# EAGLE design mac-protoshield (EAGLE 6.4)
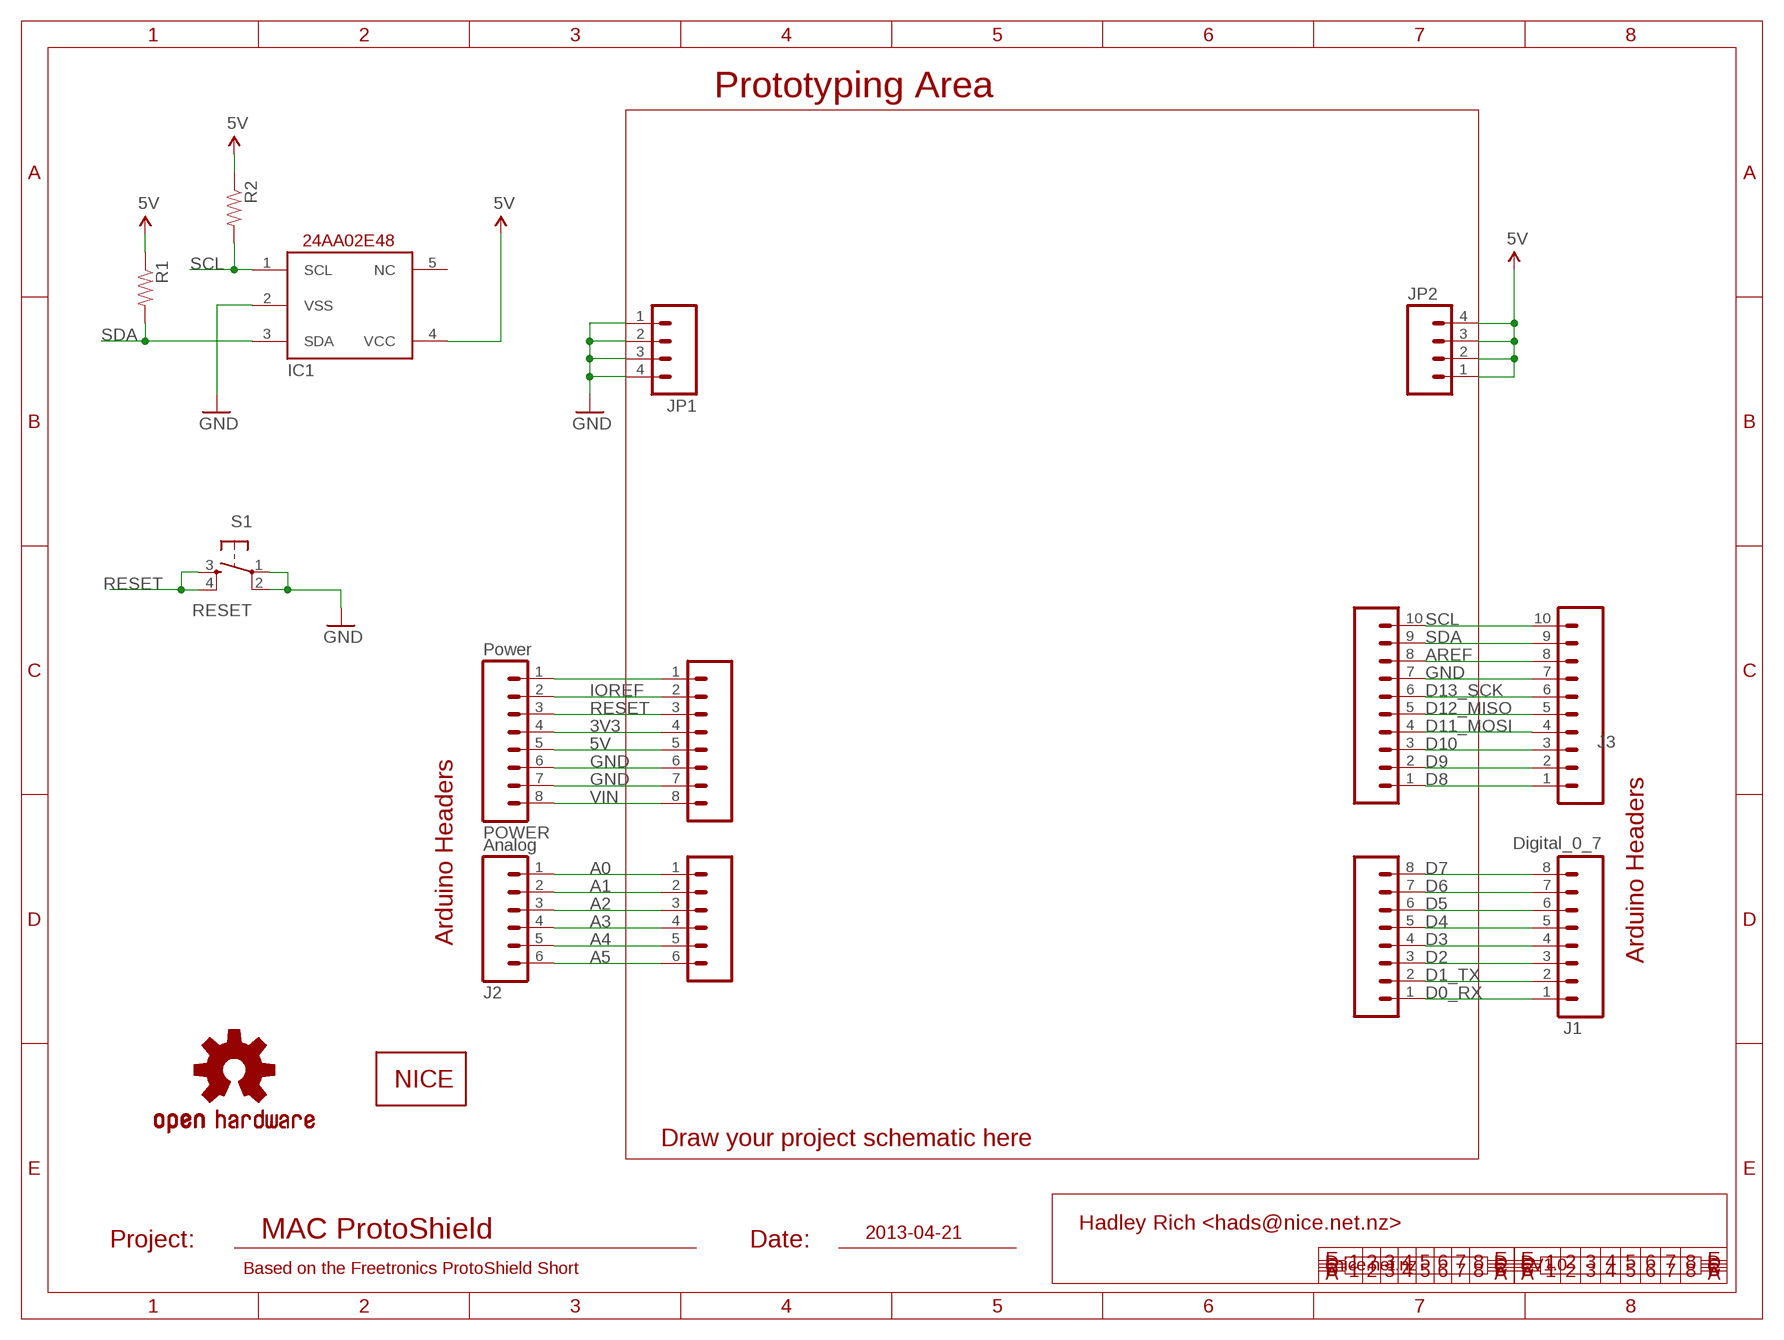
[diagram p0: schematic, sheet 1]

## Parts
IC1  24AA-2E48  [SOT23-5]
J1  Digital_0_7  M081X08  [1X08]
J2  Analog  M06SIP  [1X06]
J3  Digital_8_13  M10"  [1X10]
JP1  M04PTH  [1X04]
JP2  M04PTH  [1X04]
LOGO1  OSHW-LOGOS  [OSHW-LOGO-S]
POWER  Power  M081X08  [1X08]
R1  RESISTOR0805-RES  [0805]
R2  RESISTOR0805-RES  [0805]
S1  RESET  TAC_SWITCHPTH  [TACTILE-PTH]
SL1  Digital_0_7  M081X08  [1X08]
SL2  Analog  M06SIP  [1X06]
SL3  Digital_8_13  M10"  [1X10]
SLP  Power  M081X08  [1X08]
U$5  NICE-LOGO04  [NICE-LOGO-04]

## Nets
3V3: POWER.4 SLP.4
5V: IC1.4(VCC) JP2.1 JP2.2 JP2.3 JP2.4 POWER.5 R1.1 R2.1 SLP.5
A0: J2.1 SL2.1
A1: J2.2 SL2.2
A2: J2.3 SL2.3
A3: J2.4 SL2.4
A4: J2.5 SL2.5
A5: J2.6 SL2.6
AREF: J3.8 SL3.8
D0_RX: J1.1 SL1.1
D1_TX: J1.2 SL1.2
D2: J1.3 SL1.3
D3: J1.4 SL1.4
D4: J1.5 SL1.5
D5: J1.6 SL1.6
D6: J1.7 SL1.7
D7: J1.8 SL1.8
D8: J3.1 SL3.1
D9: J3.2 SL3.2
D10: J3.3 SL3.3
D11_MOSI: J3.4 SL3.4
D12_MISO: J3.5 SL3.5
D13_SCK: J3.6 SL3.6
GND: IC1.2(VSS) J3.7 JP1.1 JP1.2 JP1.3 JP1.4 POWER.6 POWER.7 S1.1 S1.2 SL3.7 SLP.6 SLP.7
IOREF: POWER.2 SLP.2
N$12: POWER.1 SLP.1
RESET: POWER.3 S1.3 S1.4 SLP.3
SCL: IC1.1(SCL) J3.10 R2.2 SL3.10
SDA: IC1.3(SDA) J3.9 R1.2 SL3.9
VIN: POWER.8 SLP.8
Unconnected: IC1.5(NC)

## Notes on the sheet
- Prototyping Area
- Arduino Headers
- Arduino Headers
- Draw your project schematic here
- Hadley Rich <hads@nice.net.nz>
- MAC ProtoShield | 2013-04-21
- Project: | Date:
- Based on the Freetronics ProtoShield Short | nice.net.nz | V1.0

## Library data of the parts
IC1 = nice:24AA-2E48: Microchip 24AA-2E48 2Kb EEPROM with pre-programmed EUI-48 Identity (MAC Address) SOT-23-5 package
J1 POWER SL1 SLP = SparkFun-Connectors:M08: Header 8 Standard 8-pin 0.1" header. Use with straight break away headers (SKU : PRT-00116), right angle break away headers (PRT-00553), swiss pins (PRT-00743), machine pins (PRT-00117), and female headers (PRT-00115).
J2 SL2 = SparkFun-Connectors:M06: Header 6 Standard 6-pin 0.1" header. Use with straight break away headers (SKU : PRT-00116), right angle break away headers (PRT-00553), swiss pins (PRT-00743), machine pins (PRT-00117), and female headers (PRT-00115). Molex polarized connector foot print use with SKU : PRT-08094 with associated crimp pins and housings. NOTES ON THE VARIANTS LOCK and LOCK_LONGPADS... This footprint was designed to help hold the alignment of a through-hole component (i.e. 6-pin header) while soldering it into place. You may notice that each hole has been shifted either up or down by 0.005 of an inch from it's more standard position (which is a perfectly straight line). This slight alteration caused the pins (the squares in the middle) to touch the edges of the holes. Because they are alternating, it causes a "brace" to hold the component in place. 0.005 has proven to be the perfect amount of "off-center" position when using our standard breakaway headers. Although looks a little odd when you look at the bare footprint, once you have a header in there, the alteration is very hard to notice. Also, if you push a header all the way into place, it is covered up entirely on the bottom side. This idea of altering the position of holes to aid alignment will be further integrated into the Sparkfun Library for other footprints. It can help hold any component with 3 or more connection pins.
J3 SL3 = SparkFun-Connectors:M10: Header 10 Standard 10-pin 0.1" header. Use with straight break away headers (SKU : PRT-00116), right angle break away headers (PRT-00553), swiss pins (PRT-00743), machine pins (PRT-00117), and female headers (PRT-00115).
JP1 JP2 = SparkFun-Connectors:M04: Header 4 Standard 4-pin 0.1" header. Use with straight break away headers (SKU : PRT-00116), right angle break away headers (PRT-00553), swiss pins (PRT-00743), machine pins (PRT-00117), and female headers (PRT-00115). Molex polarized connector foot print use with SKU : PRT-08231 with associated crimp pins and housings. 1MM SMD Version SKU: PRT-10208
LOGO1 = SparkFun-Aesthetics:OSHW-LOGO: Open Source Hardware Logo This logo indicates the piece of hardware it is found on incorporates a OSHW license and/or adheres to the definition of open source hardware found here: http://freedomdefined.org/OSHW
R1 R2 = SparkFun-Passives:RESISTOR: Resistor Basic schematic elements and footprints for 0603, 1206, and PTH resistors.
S1 = freetronics:TAC_SWITCH: Momentary Switch Button commonly used for reset or general input. Spark Fun Electronics SKU : COM-00097
U$5 = nice:NICE-LOGO

## Board
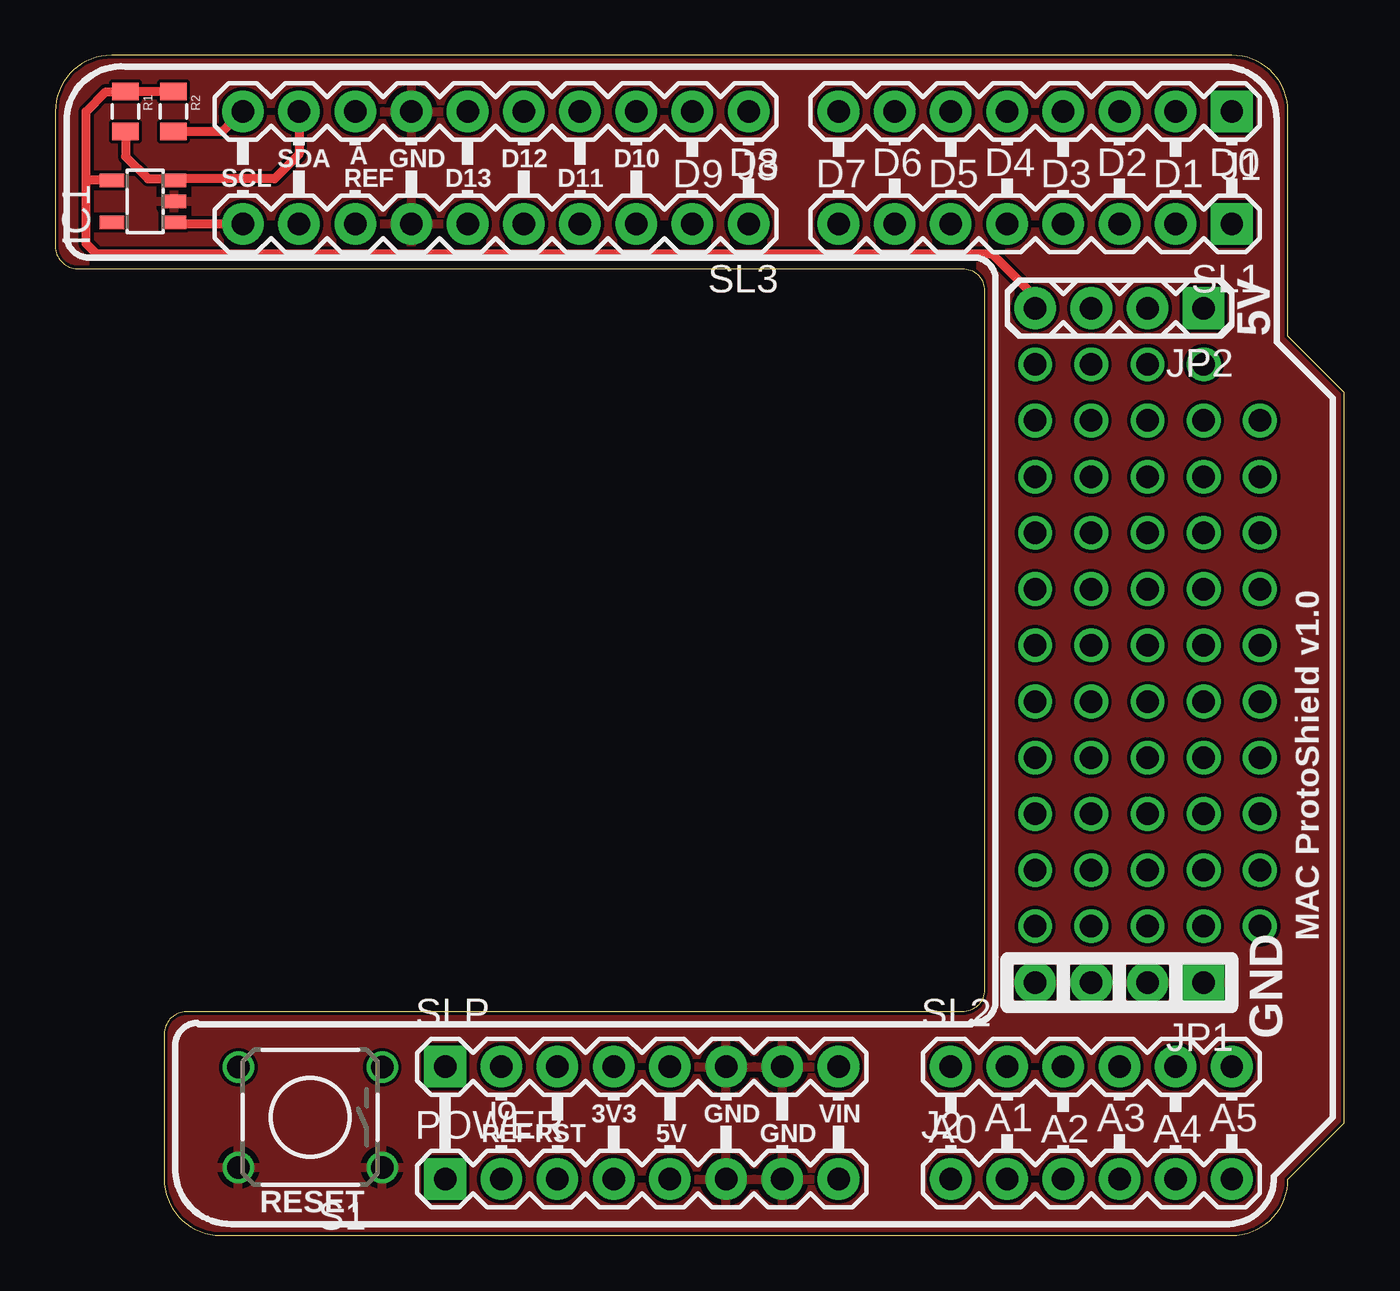
[diagram p1: board, top side]
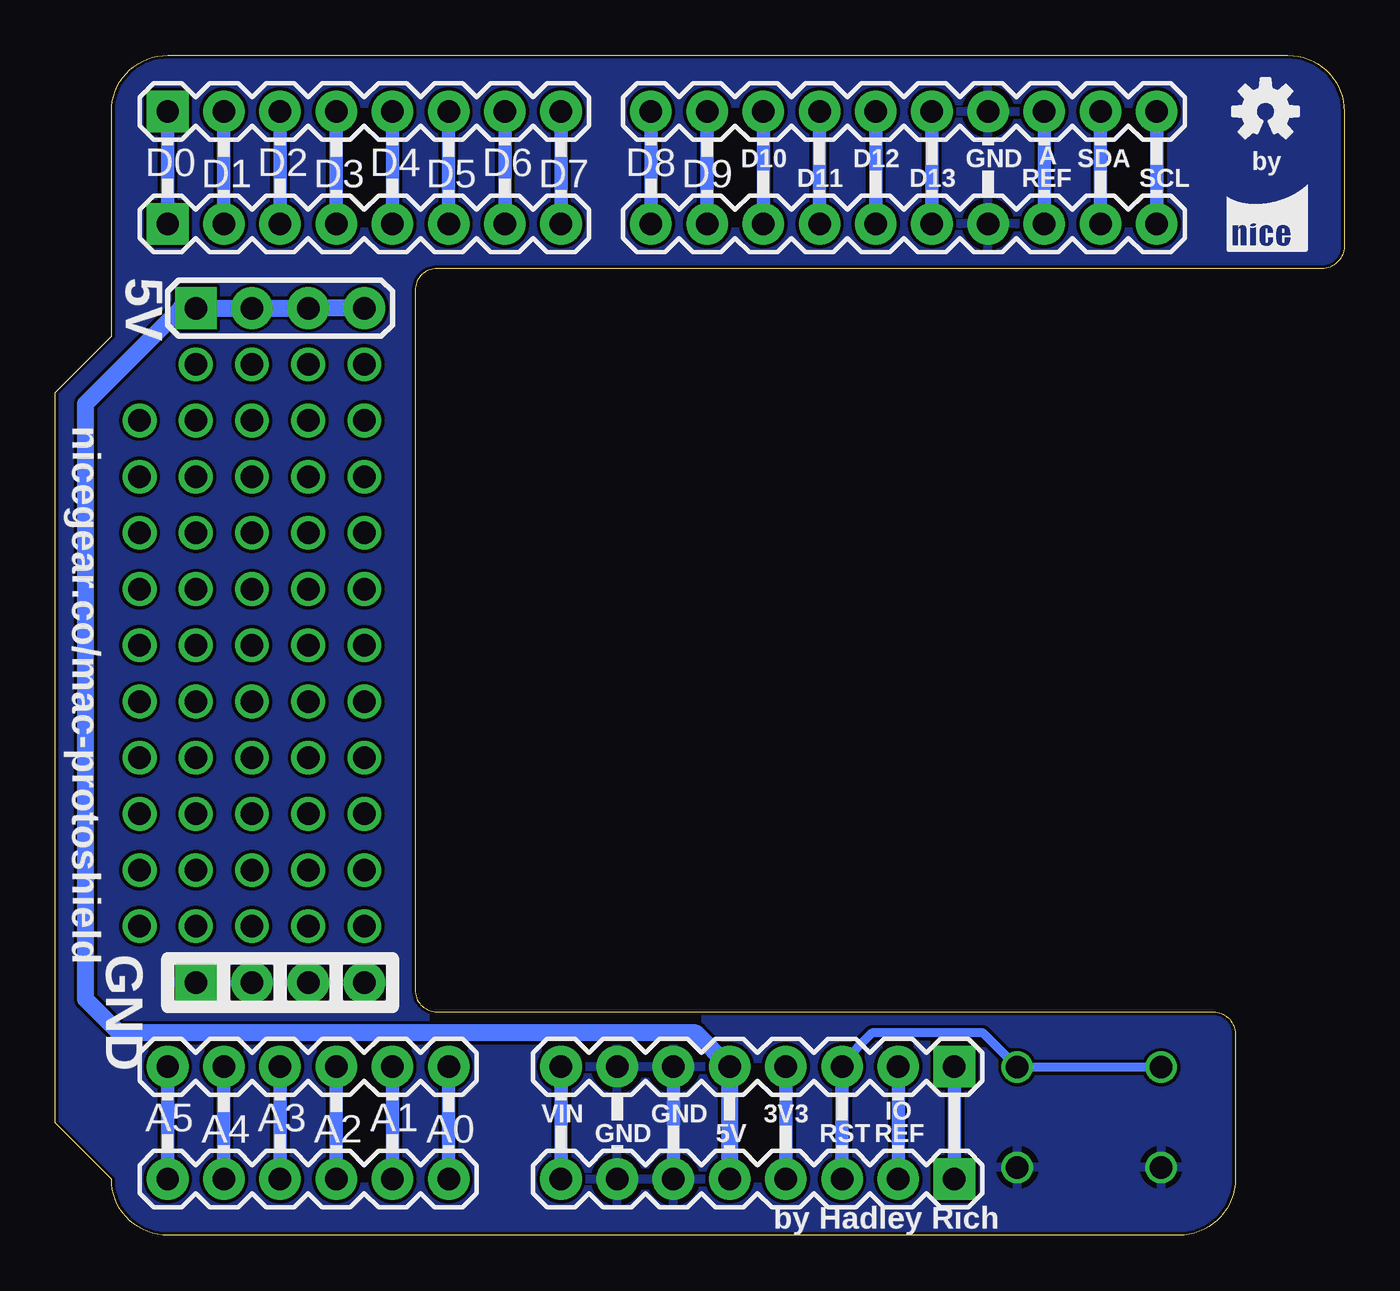
[diagram p2: board, bottom side, seen from below]

Size 58.26 x 53.34 mm. Coordinates in mm from the lower left corner, seen from the top.
Outline: 4.92,2.54 arc90 7.46,0 53.18,0 arc90 55.72,2.54 58.26,5.08 58.26,38.1 55.72,40.64 55.72,50.8 arc90 53.18,53.34 2.54,53.34 arc90 0,50.8 0,44.7 arc90 1,43.7 41,43.7 arc-90 42,42.7 42,11.1 arc-90 41,10.1 5.92,10.1 arc90 4.92,9.1 4.92,2.54
Copper layers (1*16): Top 0.035mm / dielectric 1.5mm / Bottom 0.035mm
Design rules "hads": minimum track width 6mil, minimum drill 0.3mm, track to track 6mil, track to pad 6mil, pad to pad 8mil, via to via 6mil, smd to smd 6mil, copper to edge 6mil, drill to drill 6mil, minimum pad ring 6mil, minimum via ring 10mil, stop-mask expansion 4mil, vias tented up to drill 25mil, thermal gap 10mil

### Footprints (pad centres in the part's own frame; a part is rotated, then mirrored left to right if it is on the bottom)
SOT23-5 = smd 0.6 x 1.1: 1 -0.95,-1.3; 2 0,-1.3; 3 0.95,-1.3; 4 0.95,1.5; 5 -0.95,1.5
1X08 = drill 1.016 pad 1.88 square: 1 0,0 | drill 1.016 pad 1.88: 2 2.54,0; 3 5.08,0; 4 7.62,0; 5 10.16,0; 6 12.7,0; 7 15.24,0; 8 17.78,0
1X06 = drill 1.016 pad 1.88: 1 0,0; 2 2.54,0; 3 5.08,0; 4 7.62,0; 5 10.16,0; 6 12.7,0
1X10 = drill 1.016 pad 1.88: 1 0,0; 2 2.54,0; 3 5.08,0; 4 7.62,0; 5 10.16,0; 6 12.7,0; 7 15.24,0; 8 17.78,0; 9 20.32,0; 10 22.86,0
1X04 = drill 1.016 pad 1.88 square: 1 0,0 | drill 1.016 pad 1.88: 2 2.54,0; 3 5.08,0; 4 7.62,0
0805 = smd 0.8 x 1.2: 1 -0.9,0; 2 0.9,0
TACTILE-PTH = drill 1.016: 1 -3.251,2.261; 2 3.251,2.261; 3 -3.251,-2.261; 4 3.251,-2.261

### Placement (x,y rotation side)
IC1  4.06,46.74 90 top
J1  53.18,50.8 180 top
J2  40.48,2.54 0 top
J3  31.34,50.8 180 top
JP1  51.91,11.43 180 top
JP2  51.91,41.91 180 top
LOGO1  3.56,50.8 0 bottom
POWER  17.62,2.54 0 top
R1  3.17,50.8 270 top
R2  5.33,50.8 270 top
S1  11.52,5.33 180 top
SL1  53.18,45.72 180 top
SL2  40.48,7.62 0 top
SL3  31.34,45.72 180 top
SLP  17.62,7.62 0 top
U$5  4.57,45.47 0 bottom

### Tracks (layer width: path | path; a pad name or v marks a point on that pad's centre or on a via)
3V3
  Bottom 0.61: SLP.4 POWER.4
5V
  Top 0.406: JP2.4 44.29,42.41 42.35,44.35 1.88,44.35 1.4,44.83 1.4,47.62 | R2.1 R1.1 3.14,51.69 2.29,51.69 1.4,50.8 1.4,47.62 | IC1.4 1.46,47.69 1.4,47.62
  Bottom 0.762: JP2.4 JP2.3 JP2.2 JP2.1 | POWER.5 SLP.5 29.3,9.14 55.37,9.14 56.9,10.67 56.9,37.59 52.58,41.91
  Bottom 0.813: 52.58,41.91 JP2.1
A0
  Bottom 0.61: J2.1 SL2.1
A1
  Bottom 0.61: J2.2 SL2.2
A2
  Bottom 0.61: J2.3 SL2.3
A3
  Bottom 0.61: J2.4 SL2.4
A4
  Bottom 0.61: J2.5 SL2.5
A5
  Bottom 0.61: J2.6 SL2.6
AREF
  Bottom 0.61: SL3.8 J3.8
D0_RX
  Bottom 0.61: SL1.1 J1.1
D1_TX
  Bottom 0.61: SL1.2 J1.2
D2
  Bottom 0.61: SL1.3 J1.3
D3
  Bottom 0.61: SL1.4 J1.4
D4
  Bottom 0.61: SL1.5 J1.5
D5
  Bottom 0.61: SL1.6 J1.6
D6
  Bottom 0.61: SL1.7 J1.7
D7
  Bottom 0.61: SL1.8 J1.8
D8
  Bottom 0.406: 31.24,45.72 SL3.1 31.34,45.56
  Bottom 0.61: J3.1 SL3.1
D9
  Bottom 0.61: SL3.2 J3.2
D10
  Bottom 0.61: SL3.3 J3.3
D11_MOSI
  Bottom 0.61: SL3.4 J3.4
D12_MISO
  Bottom 0.61: SL3.5 J3.5
D13_SCK
  Bottom 0.61: SL3.6 J3.6
GND
  Bottom 0.61: POWER.6 SLP.6
  pour Bottom: 0,50.8 arc-74 2.54,53.34 53.18,53.34 arc-74 55.72,50.8 55.72,40.64 58.26,38.1 58.26,5.08 55.72,2.54 arc-74 53.18,0 7.46,0 arc-74 4.92,2.54 4.92,9.1 arc-90 5.92,10.1 41,10.1 arc90 42,11.1 42,42.7 arc90 41,43.7 1,43.7 arc-90 0,44.7
  pour Top: 0,50.8 arc-74 2.54,53.34 53.18,53.34 arc-74 55.72,50.8 55.72,40.64 58.26,38.1 58.26,5.08 55.72,2.54 arc-74 53.18,0 7.46,0 arc-74 4.92,2.54 4.92,9.1 arc-90 5.92,10.1 41,10.1 arc90 42,11.1 42,42.7 arc90 41,43.7 1,43.7 arc-90 0,44.7
IOREF
  Bottom 0.61: POWER.2 SLP.2
N$5  (via drill 1.02)
  other vias: 49.37,13.97
N$7  (via drill 1.02)
  other vias: 46.83,13.97
N$8  (via drill 1.02)
  other vias: 44.29,13.97
N$12
  Bottom 0.61: SLP.1 POWER.1
N$22  (via drill 1.02)
  other vias: 49.37,16.51
N$23  (via drill 1.02)
  other vias: 46.83,16.51
N$24  (via drill 1.02)
  other vias: 44.29,16.51
N$38  (via drill 1.02)
  other vias: 49.37,19.05
N$39  (via drill 1.02)
  other vias: 46.83,19.05
N$40  (via drill 1.02)
  other vias: 44.29,19.05
N$54  (via drill 1.02)
  other vias: 49.37,21.59
N$55  (via drill 1.02)
  other vias: 46.83,21.59
N$56  (via drill 1.02)
  other vias: 44.29,21.59
N$70  (via drill 1.02)
  other vias: 49.37,24.13
N$71  (via drill 1.02)
  other vias: 46.83,24.13
N$72  (via drill 1.02)
  other vias: 44.29,24.13
N$86  (via drill 1.02)
  other vias: 49.37,26.67
N$87  (via drill 1.02)
  other vias: 46.83,26.67
N$88  (via drill 1.02)
  other vias: 44.29,26.67
N$102  (via drill 1.02)
  other vias: 49.37,29.21
N$103  (via drill 1.02)
  other vias: 46.83,29.21
N$104  (via drill 1.02)
  other vias: 44.29,29.21
N$118  (via drill 1.02)
  other vias: 49.37,31.75
N$119  (via drill 1.02)
  other vias: 46.83,31.75
N$120  (via drill 1.02)
  other vias: 44.29,31.75
N$134  (via drill 1.02)
  other vias: 49.37,34.29
N$135  (via drill 1.02)
  other vias: 46.83,34.29
N$136  (via drill 1.02)
  other vias: 44.29,34.29
N$150  (via drill 1.02)
  other vias: 49.37,36.83
N$151  (via drill 1.02)
  other vias: 46.83,36.83
N$152  (via drill 1.02)
  other vias: 44.29,36.83
N$166  (via drill 1.02)
  other vias: 49.37,39.37
N$167  (via drill 1.02)
  other vias: 46.83,39.37
N$168  (via drill 1.02)
  other vias: 44.29,39.37
N$182  (via drill 1.02)
  other vias: 51.91,13.97
N$183  (via drill 1.02)
  other vias: 51.91,16.51
N$184  (via drill 1.02)
  other vias: 51.91,19.05
N$185  (via drill 1.02)
  other vias: 51.91,21.59
N$186  (via drill 1.02)
  other vias: 51.91,24.13
N$187  (via drill 1.02)
  other vias: 51.91,26.67
N$188  (via drill 1.02)
  other vias: 51.91,29.21
N$189  (via drill 1.02)
  other vias: 51.91,31.75
N$190  (via drill 1.02)
  other vias: 51.91,34.29
N$191  (via drill 1.02)
  other vias: 51.91,36.83
N$193  (via drill 1.02)
  other vias: 54.45,13.97
N$194  (via drill 1.02)
  other vias: 54.45,16.51
N$195  (via drill 1.02)
  other vias: 54.45,19.05
N$196  (via drill 1.02)
  other vias: 54.45,21.59
N$197  (via drill 1.02)
  other vias: 54.45,24.13
N$198  (via drill 1.02)
  other vias: 54.45,26.67
N$199  (via drill 1.02)
  other vias: 54.45,29.21
N$200  (via drill 1.02)
  other vias: 54.45,31.75
N$201  (via drill 1.02)
  other vias: 54.45,34.29
N$202  (via drill 1.02)
  other vias: 54.45,36.83
N$203  (via drill 1.02)
  other vias: 51.91,39.37
RESET
  Bottom 0.406: S1.4 S1.3 16.32,9.14 21.34,9.14 22.7,7.78 SLP.3
  Bottom 0.61: SLP.3 POWER.3
SCL
  Top 0.406: IC1.1 5.43,45.72 SL3.10 | R2.2 7.58,49.9 J3.10
  Bottom 0.61: J3.10 SL3.10
SDA
  Top 0.406: J3.9 11.02,48.86 9.91,47.75 5.43,47.75 IC1.3 5.3,47.75 4.19,47.75 3.17,48.77 R1.2
  Bottom 0.61: J3.9 SL3.9
VIN
  Bottom 0.61: SLP.8 POWER.8

### Text on the board
tPlace: SDA | A | GND | D12 | D10 | D8 | D6 | D4 | D2 | D0 | SCL | REF | D13 | D11 | D9 | D7 | D5 | D3 | D1 | 5V | MAC ProtoShield v1.0 | GND | IO | 3V3 | GND | VIN | A1 | A3 | A5 | REF | RST | 5V | GND | A0 | A2 | A4 | RESET
bPlace: by | SDA | A | GND | D12 | D10 | D8 | D6 | D4 | D2 | D0 | SCL | REF | D13 | D11 | D9 | D7 | D5 | D3 | D1 | 5V | nicegear.co/mac-protoshield | GND | IO | 3V3 | GND | VIN | A1 | A3 | A5 | REF | RST | 5V | GND | A0 | A2 | A4 | by Hadley Rich